# EAGLE design R2D2_emission (EAGLE 5.06)
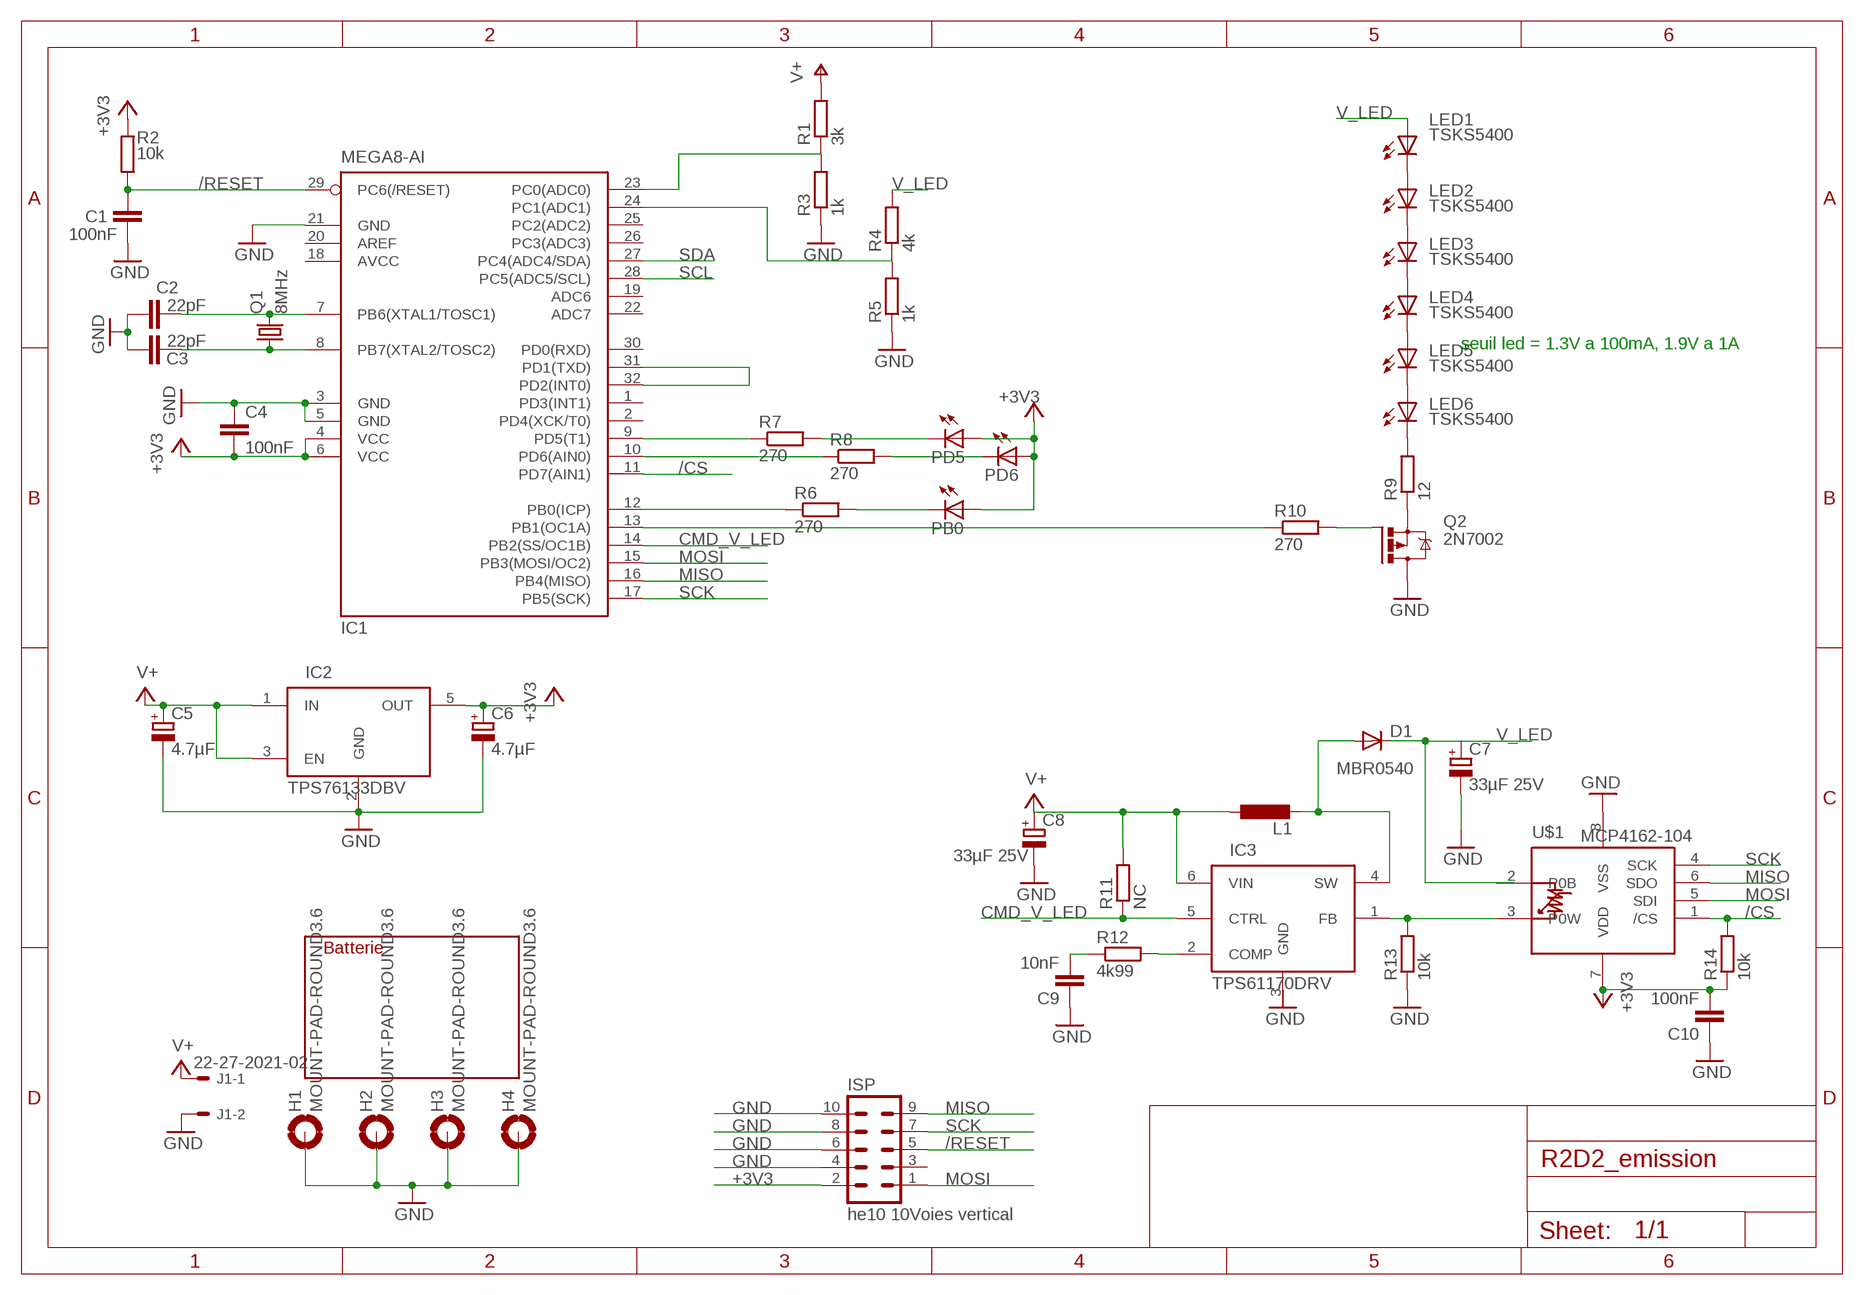
[diagram p0: schematic, sheet 1]

## Parts
BAT1  BAT_PB_6V_1A  [BATTERIE_PB_6V_1A]
C1  100nF  C-EUC0805  [C0805]
C2  22pF  C-EUC0805  [C0805]
C3  22pF  C-EUC0805  [C0805]
C4  100nF  C-EUC0805  [C0805]
C5  4.7µF  CPOL-EUE2-4  [E2-4]
C6  4.7µF  CPOL-EUE2-4  [E2-4]
C7  33µF 25V  CPOL-EUD/7343-31W  [D/7343-31W]
C8  33µF 25V  CPOL-EUD/7343-31W  [D/7343-31W]
C9  10nF  C-EUC0805  [C0805]
C10  100nF  C-EUC0805  [C0805]
D1  MBR0540  MBR0520LT  [SOD123]
H1  MOUNT-PAD-ROUND3.6  [3,6-PAD]
H2  MOUNT-PAD-ROUND3.6  [3,6-PAD]
H3  MOUNT-PAD-ROUND3.6  [3,6-PAD]
H4  MOUNT-PAD-ROUND3.6  [3,6-PAD]
IC1  MEGA8-AI  [TQFP32-08]
IC2  TPS76133DBV  [SOT23-5]
IC3  TPS61170DRV  [QFN6]
ISP  he10 10Voies vertical  ML10L  [ML10L]
J1  22-27-2021-02  [6410-02]
L1  L-EUL1812  [L1812]
LED1  TSKS5400  LEDSQR2X5  [LED2X5]
LED2  TSKS5400  LEDSQR2X5  [LED2X5]
LED3  TSKS5400  LEDSQR2X5  [LED2X5]
LED4  TSKS5400  LEDSQR2X5  [LED2X5]
LED5  TSKS5400  LEDSQR2X5  [LED2X5]
LED6  TSKS5400  LEDSQR2X5  [LED2X5]
PB0  LEDCHIP-LED0805  [CHIP-LED0805]
PD5  LEDCHIP-LED0805  [CHIP-LED0805]
PD6  LEDCHIP-LED0805  [CHIP-LED0805]
Q1  8MHz  CRYSTALHC49S  [HC49/S]
Q2  2N7002  [SOT23]
R1  3k  R-EU_R0805  [R0805]
R2  10k  R-EU_R0805  [R0805]
R3  1k  R-EU_R0805  [R0805]
R4  4k  R-EU_R0805  [R0805]
R5  1k  R-EU_R0805  [R0805]
R6  270  R-EU_R0805  [R0805]
R7  270  R-EU_R0805  [R0805]
R8  270  R-EU_R0805  [R0805]
R9  12  R-EU_R1210  [R1210]
R10  270  R-EU_R0805  [R0805]
R11  NC  R-EU_M0805  [M0805]
R12  4k99  R-EU_R0805  [R0805]
R13  10k  R-EU_R0805  [R0805]
R14  10k  R-EU_0207/12  [0207/12]
U$1  MCP4162-104  MCP4142  [TSSOP14]

## Nets
+3V3: C4.2 C6.+ C10.2 IC1.4(VCC) IC1.6(VCC) IC2.5(OUT) ISP.2 PB0.A PD5.A PD6.A R2.2 R14.1 U$1.7(VDD)
/CS: IC1.11(PD7(AIN1)) R14.2 U$1.1(/CS)
/RESET: C1.1 IC1.29(PC6(/RESET)) ISP.5 R2.1
CMD_V_LED: IC1.14(PB2(SS/OC1B)) IC3.5(CTRL) R11.1
GND: C1.2 C2.1 C3.1 C4.1 C5.- C6.- C7.- C8.- C9.1 C10.1 H1.B3,6(MOUNT) H2.B3,6(MOUNT) H3.B3,6(MOUNT) H4.B3,6(MOUNT) IC1.3(GND) IC1.5(GND) IC1.21(GND) IC2.2(GND) ISP.4 ISP.6 ISP.8 ISP.10 J1.2 Q2.2(D) R3.1 R5.1 R13.1 U$1.8(VSS)
MISO: IC1.16(PB4(MISO)) ISP.9 U$1.6(SDO)
MOSI: IC1.15(PB3(MOSI/OC2)) ISP.1 U$1.5(SDI)
N$1: C2.2 IC1.7(PB6(XTAL1/TOSC1)) Q1.2
N$2: C3.2 IC1.8(PB7(XTAL2/TOSC2)) Q1.1
N$3: LED1.K(C) LED2.A
N$4: LED3.K(C) LED4.A
N$5: IC1.12(PB0(ICP)) R6.1
N$6: LED5.K(C) LED6.A
N$7: IC3.1(FB) R13.2 U$1.3(P0W)
N$8: IC1.23(PC0(ADC0)) R1.1 R3.2
N$9: LED6.K(C) R9.2
N$10: Q2.3(S) R9.1
N$11: LED4.K(C) LED5.A
N$13: IC1.31(PD1(TXD)) IC1.32(PD2(INT0))
N$14: IC3.2(COMP) R12.2
N$15: Q2.1(G) R10.2
N$16: IC1.13(PB1(OC1A)) R10.1
N$17: C9.2 R12.1
N$18: LED2.K(C) LED3.A
N$19: D1.A IC3.4(SW) L1.2
N$20: IC1.24(PC1(ADC1)) R4.1 R5.2
N$22: IC1.9(PD5(T1)) R7.1
N$23: IC1.10(PD6(AIN0)) R8.1
N$25: PB0.C R6.2
N$26: PD5.C R7.2
N$27: PD6.C R8.2
SCK: IC1.17(PB5(SCK)) ISP.7 U$1.4(SCK)
SCL: IC1.28(PC5(ADC5/SCL))
SDA: IC1.27(PC4(ADC4/SDA))
V+: C5.+ C8.+ IC2.1(IN) IC2.3(EN) IC3.6(VIN) J1.1 L1.1 R1.2 R11.2
V_LED: C7.+ D1.C LED1.A R4.2 U$1.2(P0B)
Unconnected: IC1.1(PD3(INT1)) IC1.2(PD4(XCK/T0)) IC1.19(ADC6) IC1.20(AREF) IC1.22(ADC7) IC1.25(PC2(ADC2)) IC1.26(PC3(ADC3)) IC1.30(PD0(RXD)) ISP.3

## Notes on the sheet
- seuil led = 1.3V a 100mA, 1.9V a 1A

## Power pins joined to a net without a drawn wire
AVCC: IC1.18(AVCC)
GND: IC3.3(GND)

## Library data of the parts
BAT1 = robotter:BAT_PB_6V_1A
C1-C4 C9 C10 = rcl:C-EU: CAPACITOR, European symbol
C5-C8 = rcl:CPOL-EU: POLARIZED CAPACITOR, European symbol
D1 = diode:MBR0520LT: SCHOTTKY BARRIER RECTIFIER Source: http://onsemi.com .. MBR0520LT1-D.pdf
H1-H4 = holes:MOUNT-PAD-ROUND: MOUNTING PAD, round
IC1 = atmel:MEGA8: MICROCONTROLLER 8 Kbytes FLASH, 1 kbytes SRAM, 512 bytes EEPROM, USART, 6-channel 10 bit ADC, 2-channel 8 bit ADC Pin compatible with Atmega48, ATMega88, ATMega168 Source: avr.lbr
IC2 = robotter:TPS76133
IC3 = robotter:TPS61170
ISP = con-harting-ml:ML10: HARTING
J1 = con-molex:22-?-02: CONNECTOR wire to board 2.54 mm (.1 inch) pitch header
L1 = rcl:L-EU: INDUCTOR, European symbol
LED1-LED6 PB0 PD5 PD6 = led:LED: LED OSRAM: - CHIPLED LG R971, LG N971, LY N971, LG Q971, LY Q971, LO R971, LY R971 LH N974, LH R974 LS Q976, LO Q976, LY Q976 LO Q996 - Hyper CHIPLED LW Q18S LB Q993, LB Q99A, LB R99A - SideLED LS A670, LO A670, LY A670, LG A670, LP A670 LB A673, LV A673, LT A673, LW A673 LH A674 LY A675 LS A676, LA A676, LO A676, LY A676, LW A676 LS A679, LY A679, LG A679 - Hyper Micro SIDELED® LS Y876, LA Y876, LO Y876, LY Y876 LT Y87S - SmartLED LW L88C, LW L88S LB L89C, LB L89S, LG L890 LS L89K, LO L89K, LY L89K LS L896, LA L896, LO L896, LY L896 - TOPLED LS T670, LO T670, LY T670, LG T670, LP T670 LSG T670, LSP T670, LSY T670, LOP T670, LYG T670 LG T671, LOG T671, LSG T671 LB T673, LV T673, LT T673, LW T673 LH T674 LS T676, LA T676, LO T676, LY T676, LB T676, LH T676, LSB T676, LW T676 LB T67C, LV T67C, LT T67C, LS T67K, LO T67K, LY T67K, LW E67C LS E67B, LA E67B, LO E67B, LY E67B, LB E67C, LV E67C, LT E67C LW T67C LS T679, LY T679, LG T679 LS T770, LO T770, LY T770, LG T770, LP T770 LB T773, LV T773, LT T773, LW T773 LH T774 LS E675, LA E675, LY E675, LS T675 LS T776, LA T776, LO T776, LY T776, LB T776 LHGB T686 LT T68C, LB T68C - Hyper Mini TOPLED® LB M676 - Mini TOPLED Santana® LG M470 LS M47K, LO M47K, LY M47K Source: http://www.osram.convergy.de LUXEON: - LUMILED® LXK2-PW12-R00, LXK2-PW12-S00, LXK2-PW14-U00, LXK2-PW14-V00 LXK2-PM12-R00, LXK2-PM12-S00, LXK2-PM14-U00 LXK2-PE12-Q00, LXK2-PE12-R00, LXK2-PE12-S00, LXK2-PE14-T00, LXK2-PE14-U00 LXK2-PB12-K00, LXK2-PB12-L00, LXK2-PB12-M00, LXK2-PB14-N00, LXK2-PB14-P00, LXK2-PB14-Q00 LXK2-PR12-L00, LXK2-PR12-M00, LXK2-PR14-Q00, LXK2-PR14-R00 LXK2-PD12-Q00, LXK2-PD12-R00, LXK2-PD12-S00 LXK2-PH12-R00, LXK2-PH12-S00 LXK2-PL12-P00, LXK2-PL12-Q00, LXK2-PL12-R00 Source: www.luxeon.com KINGBRIGHT: KA-3528ASYC Source: www.kingbright.com
Q1 = crystal:CRYSTAL: CRYSTAL
Q2 = robotter:2N7002
R1-R14 = rcl:R-EU_: RESISTOR, European symbol
U$1 = robotter:MCP4142

## Board
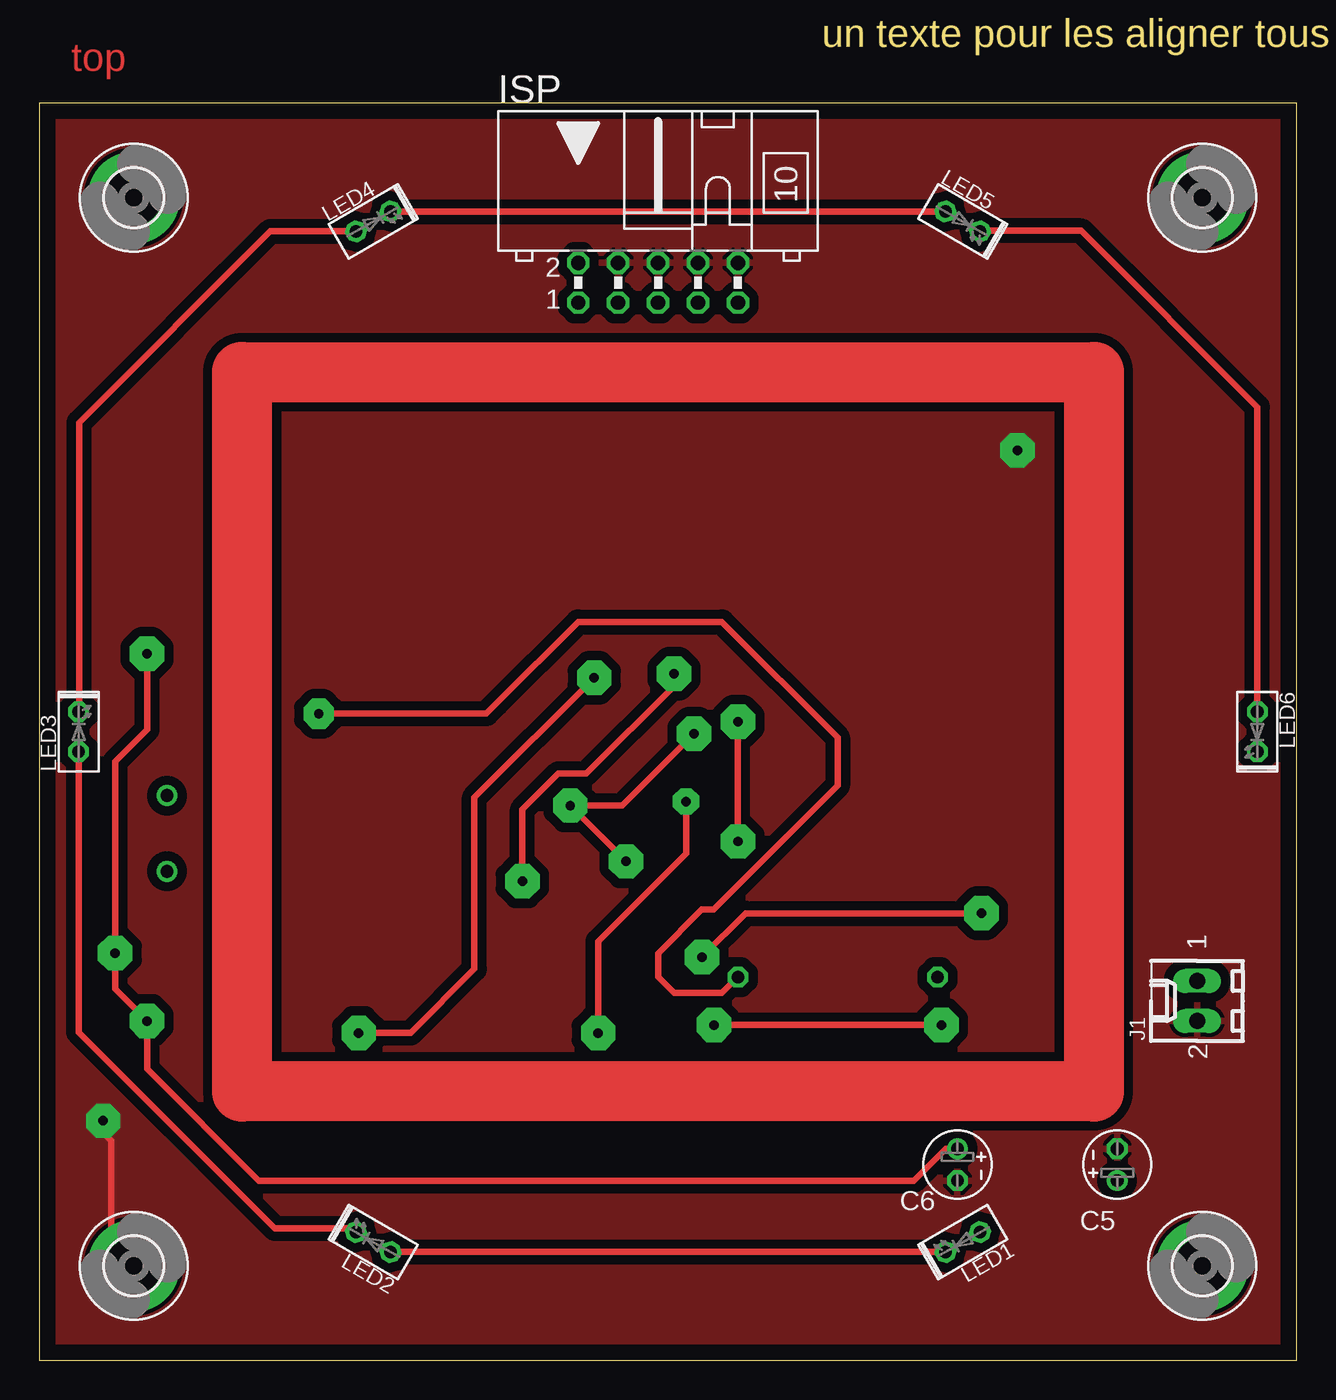
[diagram p1: board, top side]
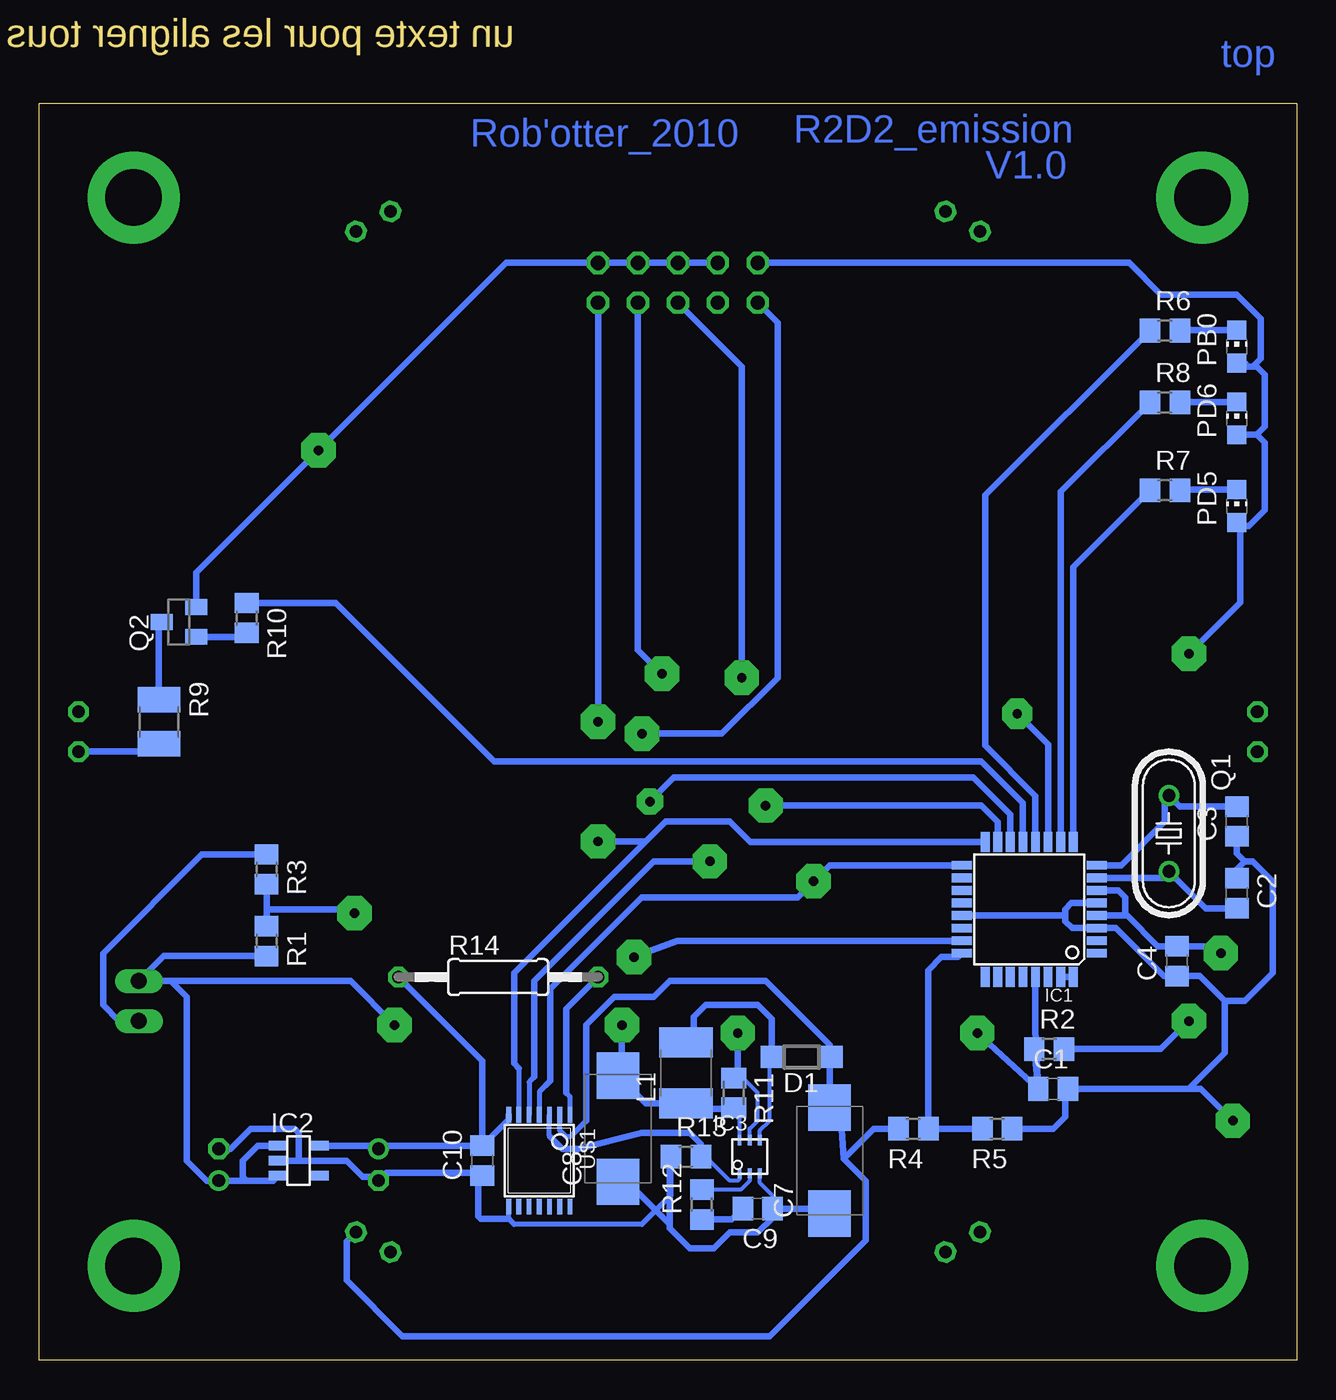
[diagram p2: board, bottom side, seen from below]

Size 80 x 80 mm. Coordinates in mm from the lower left corner, seen from the top.
Outline: 0,0 80,0 80,80 0,80 0,0
Copper layers (1*16): Top 0.035mm / dielectric 1.5mm / Bottom 0.035mm
Design rules "default *": minimum track width 10mil, minimum drill 10mil, track to track 0.6mm, track to pad 0.2mm, pad to pad 0.2mm, via to via 0.2mm, smd to smd 8mil, copper to edge 40mil, drill to drill 8mil, minimum pad ring 10mil, minimum via ring 8mil, stop-mask expansion 4mil, vias tented up to drill 0mil, thermal gap 10mil

### Footprints (pad centres in the part's own frame; a part is rotated, then mirrored left to right if it is on the bottom)
C0805 = smd 1.3 x 1.5: 1 -0.95,0; 2 0.95,0
E2-4 = drill 0.813 pad 1.27 round: + -1.016,0 | drill 0.813 pad 1.27 octagon: - 1.016,0
D/7343-31W = smd 2.95 x 2.7: + 3.375,0; - -3.375,0
SOD123 = smd 1.4 x 1.4: A 1.9,0; C -1.9,0
3,6-PAD = drill 3.6 pad 5.842 round: B3,6 0,0
TQFP32-08 = smd 1.27 x 0.559: 1 -4.293,2.8; 2 -4.293,2; 3 -4.293,1.2; 4 -4.293,0.4; 5 -4.293,-0.4; 6 -4.293,-1.2; 7 -4.293,-2; 8 -4.293,-2.8; 17 4.293,-2.8; 18 4.293,-2; 19 4.293,-1.2; 20 4.293,-0.4; 21 4.293,0.4; 22 4.293,1.2; 23 4.293,2; 24 4.293,2.8 | smd 0.559 x 1.27: 9 -2.8,-4.293; 10 -2,-4.293; 11 -1.2,-4.293; 12 -0.4,-4.293; 13 0.4,-4.293; 14 1.2,-4.293; 15 2,-4.293; 16 2.8,-4.293; 25 2.8,4.293; 26 2,4.293; 27 1.2,4.293; 28 0.4,4.293; 29 -0.4,4.293; 30 -1.2,4.293; 31 -2,4.293; 32 -2.8,4.293
SOT23-5 = smd 0.6 x 1.2: 1 -0.95,-1.306; 2 0,-1.306; 3 0.95,-1.306; 4 0.95,1.306; 5 -0.95,1.306
QFN6 = smd 0.25 x 0.65: 1 -0.65,-1.05; 2 0,-1.05; 3 0.65,-1.05; 4 0.65,1.05; 5 0,1.05; 6 -0.65,1.05
ML10L = drill 0.914 octagon: 1 -5.08,-1.27; 2 -5.08,1.27; 3 -2.54,-1.27; 4 -2.54,1.27; 5 0,-1.27; 6 0,1.27; 7 2.54,-1.27; 8 2.54,1.27; 9 5.08,-1.27; 10 5.08,1.27
6410-02 = drill 1.016 long: 1 1.27,0; 2 -1.27,0
L1812 = smd 1.9 x 3.4: 1 -1.95,0; 2 1.95,0
LED2X5 = drill 0.813 octagon: A -1.27,0; K 1.27,0
CHIP-LED0805 = smd 1.2 x 1.2: A 0,-1.05; C 0,1.05
HC49/S = drill 0.813 round: 1 -2.413,0; 2 2.413,0
SOT23 = smd 1 x 1.4: 1 -0.95,-1.1; 2 0.95,-1.1; 3 0,1.1
R0805 = smd 1.3 x 1.5: 1 -0.95,0; 2 0.95,0
R1210 = smd 1.6 x 2.7: 1 -1.4,0; 2 1.4,0
M0805 = smd 1.3 x 1.6: 1 -0.95,0; 2 0.95,0
0207/12 = drill 0.813 octagon: 1 -6.35,0; 2 6.35,0
TSSOP14 = smd 0.305 x 0.991: 1 -2.275,-2.918; 2 -1.625,-2.918; 3 -0.975,-2.918; 4 -0.325,-2.918; 5 0.325,-2.918; 6 0.975,-2.918; 7 1.625,-2.918; 8 1.625,2.918; 9 0.975,2.918; 10 0.325,2.918; 11 -0.325,2.918; 12 -0.975,2.918; 13 -1.625,2.918; 14 -2.275,2.918

### Placement (x,y rotation side)
BAT1  40,40 0 top
C1  15.49,17.27 0 bottom
C2  3.81,29.72 270 bottom
C3  3.81,34.29 90 bottom
C4  7.62,25.4 90 bottom
C5  68.58,12.45 90 top
C6  58.42,12.45 270 top
C7  29.72,12.7 90 bottom
C8  43.18,14.73 90 bottom
C9  34.29,9.65 180 bottom
C10  51.82,12.7 90 bottom
D1  31.5,19.3 180 bottom
H1  6,74 0 top
H2  74,74 0 top
H3  6,6 0 top
H4  74,6 0 top
IC1  17.02,28.7 180 bottom
IC2  63.5,12.7 270 bottom
IC3  34.8,12.95 0 bottom
ISP  39.37,68.58 0 top
J1  73.66,22.86 90 top
L1  38.86,18.29 90 bottom
LED1  58.75,7.52 210 top
LED2  21.25,7.52 150 top
LED3  2.5,40 90 top
LED4  21.25,72.48 30 top
LED5  58.75,72.48 330 top
LED6  77.5,40 270 top
PB0  3.81,64.52 0 bottom
PD5  3.81,54.36 0 bottom
PD6  3.81,59.94 0 bottom
Q1  8.13,33.53 270 bottom
Q2  71.12,46.99 90 bottom
R1  65.53,26.67 270 bottom
R2  15.75,19.81 0 bottom
R3  65.53,31.24 270 bottom
R4  24.38,14.73 180 bottom
R5  19.05,14.73 180 bottom
R6  8.38,65.53 0 bottom
R7  8.38,55.37 0 bottom
R8  8.38,60.96 0 bottom
R9  72.39,40.64 270 bottom
R10  66.8,47.24 270 bottom
R11  35.81,17.02 270 bottom
R12  37.85,9.91 90 bottom
R13  38.86,12.95 0 bottom
R14  50.8,24.38 0 bottom
U$1  48.51,12.7 180 bottom

### Tracks (layer width: path | path; a pad name or v marks a point on that pad's centre or on a via)
+3V3  (via drill 0.6 pad 2.18)
  Top 0.406: C6.+ 57.66,13.46 55.63,11.43 13.97,11.43 6.86,18.54 v6.86,21.59 4.83,23.62 v4.83,25.91 4.83,38.1 6.86,40.13 v6.86,44.96
  Bottom 0.406: IC2.5 58.61,13.65 C6.+ 58.23,13.65 C10.2 | 10.92,28.3 10.78,28.3 8.82,26.35 C4.2 5.27,26.35 v4.83,25.91 | 10.92,28.3 IC1.4 | IC1.6 11.36,29.9 10.92,29.46 10.92,28.3 | 3.27,63.47 PB0.A 3.59,63.25 2.79,63.25 | 2.54,58.93 2.03,59.44 2.03,62.74 2.54,63.25 2.79,63.25 | 2.54,58.93 2.03,58.42 2.03,54.1 3.05,53.09 3.59,53.09 | 3.59,53.09 PD5.A | 2.54,58.93 3.78,58.93 PD6.A | ISP.2 10.67,69.85 8.64,67.82 3.81,67.82 2.29,66.29 2.29,63.75 2.79,63.25 | R2.2 8.64,19.81 v6.86,21.59 | C10.2 50.14,15.33 U$1.7 | 3.59,53.09 3.59,48.23 v6.86,44.96 | C10.2 51.82,19.05 R14.1
/CS  (via drill 0.6 pad 1.93)
  Top 0.406: R14.2 43.43,23.37 40.39,23.37 39.37,24.38 39.37,25.91 42.16,28.7 42.93,28.7 50.8,36.58 50.8,39.62 43.43,46.99 34.29,46.99 29.08,41.78 28.45,41.15 v17.78,41.15
  Bottom 0.305: U$1.1 46.24,16.77 46.48,17.02
  Bottom 0.406: 46.48,17.02 46.48,22.35 R14.2 | IC1.11 15.82,39.19 v17.78,41.15
/RESET  (via drill 0.6 pad 2.18)
  Top 0.406: v35.31,43.43 27.69,35.81 27.69,24.89 23.62,20.83 v20.32,20.83
  Bottom 0.406: IC1.29 16.62,21 C1.1 | ISP.5 35.31,63.25 v35.31,43.43 | C1.1 v20.32,20.83 | C1.1 R2.1
CMD_V_LED  (via drill 0.6 pad 1.68, 0.6 pad 2.18)
  Top 0.406: v35.56,20.83 35.56,21.34 | 35.56,21.34 35.56,23.88 | 35.56,21.34 35.56,26.67 40.89,32 41.15,32.26 v41.15,35.56
  Bottom 0.254: IC3.5 34.8,14.73 34.29,15.24 34.29,17.02 35.31,18.03 35.75,18.03 R11.1
  Bottom 0.406: 35.31,18.03 35.56,18.29 v35.56,20.83 | IC1.14 18.22,34.73 20.57,37.08 39.62,37.08 v41.15,35.56
GND  (via drill 0.6 pad 2.18)
  Top 0.406: v4.06,15.24 4.06,14.48 4.57,13.97 4.57,7.43 H3.B3,6
  Bottom 0.254: IC3.3 34.15,11.29 33.27,10.41 33.27,9.72 C9.1
  Bottom 0.305: R13.1 39.81,10.48 41.66,8.64 49.78,8.64 50.14,8.99 U$1.8
  Bottom 0.406: C7.- 30.05,9.65 C9.1 33.34,9.08 34.29,8.13 36.07,8.13 37.08,7.11 38.61,7.11 39.88,8.38 39.88,8.64 | R13.1 39.88,12.89 39.88,8.64 | 63.5,12.7 IC2.2 | 63.5,12.7 60.45,12.7 59.44,11.68 58.67,11.68 C6.- 57.91,11.94 52.51,11.94 52.07,11.5 | C5.- 67.82,13.46 66.55,14.73 63.75,14.73 63.5,14.48 63.5,12.7 | R3.1 69.66,32.19 75.95,25.91 75.95,22.61 74.93,21.59 J1.2 | IC1.5 14.33,29.1 14.73,28.7 14.73,28.19 | 14.73,28.19 14.73,27.94 14.29,27.5 IC1.3 11.5,27.5 8.45,24.45 C4.1 6.16,24.45 4.57,22.86 | C2.1 3.81,31.24 3.3,31.75 | 3.3,31.75 2.79,31.75 1.52,30.48 1.52,24.64 3.3,22.86 4.57,22.86 | C3.1 3.81,32.26 3.3,31.75 | ISP.6 ISP.4 ISP.8 43.94,69.85 | 43.94,69.85 ISP.10 | 6.86,17.27 C1.2 14.73,17.08 14.73,15.49 15.49,14.73 R5.1 | 6.86,17.27 4.57,19.56 4.57,22.86 | 52.07,11.5 C10.1 | 52.07,11.5 52.07,9.14 51.92,8.99 50.14,8.99 | C8.- 42.6,11.36 39.88,8.64 | 6.86,17.27 6.1,17.27 v4.06,15.24 | Q2.2 70.02,50.12 v62.23,57.91 50.29,69.85 43.94,69.85 | IC1.21 14.84,28.3 14.73,28.19
  pour Top: 0,0 0,80.01 80.26,80.01 80.26,0 0.25,0
  pour Top: 14.99,60.96 14.99,19.05 65.02,19.05 65.02,60.96
MISO  (via drill 0.6 pad 2.18)
  Top 0.406: v44.45,33.02 v44.45,40.64
  Bottom 0.305: 49.49,18.58 U$1.6
  Bottom 0.406: 49.49,18.58 49.78,18.88 49.78,24.64 41.4,33.02 | 41.4,33.02 40.13,34.29 36.07,34.29 34.92,33.15 34.77,32.99 IC1.16 | v44.45,40.64 ISP.9 | 41.4,33.02 v44.45,33.02
MOSI  (via drill 0.6 pad 2.18)
  Top 0.406: v37.34,31.75 v33.78,35.31 37.08,35.31 v41.66,39.88
  Bottom 0.305: U$1.5 48.84,17.71 48.51,18.03
  Bottom 0.406: IC1.15 19.02,34.26 20.07,35.31 v33.78,35.31 | 48.51,18.03 48.51,24.13 40.89,31.75 v37.34,31.75 | ISP.1 33.02,66.04 33.02,43.43 36.58,39.88 v41.66,39.88
N$1
  Bottom 0.406: IC1.7 8.54,30.7 Q1.2 5.78,28.77 C2.2
N$2
  Bottom 0.406: IC1.8 11.17,31.5 8.38,34.29 8.38,35.69 Q1.1 7.43,35.24 C3.2
N$3
  Top 0.406: LED2.A LED1.K
N$4
  Top 0.406: LED4.A 14.7,71.84 2.54,59.69 2.54,41.31 LED3.K
N$5
  Bottom 0.406: IC1.12 16.62,35.92 19.81,39.12 19.81,55.05 R6.1
N$6
  Top 0.406: LED6.A 77.5,60.68 66.29,71.88 59.89,71.88 LED5.K
N$7
  Bottom 0.254: IC3.1 35.45,11.54 35.56,11.43 36.07,11.43 37.34,12.7 37.66,12.7 R13.2
  Bottom 0.305: U$1.3 47.54,14.27 47.5,14.22
  Bottom 0.406: R13.2 37.91,13.78 38.61,14.48 41.66,14.48 45.72,13.46 46.74,13.46 47.5,14.22
N$8  (via drill 0.6 pad 2.18)
  Top 0.406: v59.94,28.45 44.96,28.45 v42.16,25.65
  Bottom 0.406: 65.53,28.7 R1.1 | 65.53,28.7 R3.2 | IC1.23 39.4,26.7 v42.16,25.65 | v59.94,28.45 60.2,28.7 65.53,28.7
N$9
  Bottom 0.406: LED6.K 72.9,38.73 R9.2
N$10
  Bottom 0.406: R9.1 72.39,46.82 Q2.3
N$11
  Top 0.406: LED4.K LED5.A
N$13
  Bottom 0.406: IC1.31 IC1.32
N$14
  Bottom 0.254: IC3.2 34.8,11.43 35.37,10.86 R12.2
N$15
  Bottom 0.406: Q2.1 67.06,46.04 R10.2
N$16
  Bottom 0.406: IC1.13 17.42,35.45 20.07,38.1 51.05,38.1 61.15,48.19 R10.1
N$17
  Bottom 0.406: C9.2 35.94,8.96 R12.1
N$18
  Top 0.406: LED3.A 2.5,20.87 14.99,8.38 19.92,8.38 LED2.K
N$19
  Bottom 0.254: IC3.4 34.15,14.62 33.53,15.24 33.53,19.17 D1.A
  Bottom 0.406: 33.9,19.81 D1.A 33.4,21.71 34.29,22.61 37.59,22.61 38.35,21.84 38.35,19.89 38.44,19.81 L1.2
N$20
  Bottom 0.406: R5.2 R4.1 23.43,24.83 22.61,25.65 21.56,25.65 IC1.24
N$22
  Bottom 0.406: IC1.9 14.22,50.49 R7.1
N$23
  Bottom 0.406: IC1.10 15.02,55.27 R8.1
N$25
  Bottom 0.406: PB0.C 7.4,65.57 R6.2
N$26
  Bottom 0.406: PD5.C 7.4,55.41 R7.2
N$27
  Bottom 0.406: PD6.C 7.4,60.99 R8.2
SCK  (via drill 0.6 pad 2.18)
  Top 0.406: v30.73,30.48 30.73,35.05 33.02,37.34 34.8,37.34 40.39,42.93 v40.39,43.69
  Bottom 0.305: U$1.4 48.19,17.09 47.75,17.53
  Bottom 0.406: 47.75,17.53 47.5,17.78 47.5,23.62 41.66,29.46 31.75,29.46 v30.73,30.48 29.84,31.37 29.71,31.5 IC1.17 | ISP.7 41.91,45.21 v40.39,43.69
V+  (via drill 0.6 pad 2.18)
  Top 0.406: v42.93,21.34 v57.4,21.34
  Bottom 0.254: IC3.6 35.45,15.7 R11.2
  Bottom 0.406: R11.2 35.88,16 38.86,16 L1.1 41.41,16.34 C8.+ 42.93,18.36 v42.93,21.34 | 66.8,11.43 C5.+ 69.34,11.43 70.61,12.7 70.61,23.11 71.63,24.13 J1.1 | 66.8,11.43 65.13,11.43 IC2.3 | IC2.1 66.11,13.65 67.06,12.7 67.06,11.68 66.8,11.43 | v57.4,21.34 60.2,24.13 J1.1 | R1.2 72.07,25.72 J1.1
V_LED
  Bottom 0.305: U$1.2 46.89,14.63 46.48,14.22 46.23,14.22 45.21,15.24
  Bottom 0.406: 45.21,15.24 45.21,21.34 43.43,23.11 40.89,23.11 39.88,24.13 33.78,24.13 33.02,23.37 29.72,20.07 29.72,19.43 D1.C 29.72,19.18 C7.+ 29.03,16.07 28.83,12.83 | 28.83,12.83 27.43,11.43 27.43,7.62 33.53,1.52 56.9,1.52 60.45,5.08 60.45,7.55 LED1.A | R4.2 26.92,14.73 28.83,12.83

### Text on the board
Top: top
Bottom: top | R2D2_emission | Rob'otter_2010 | V1.0
Dimension: un texte pour les aligner tous